# Altium schematic sheet RECEPTOR_AIS_BLK_R00.SchDoc
size A4; SheetNumber: 1; SheetTotal: 5
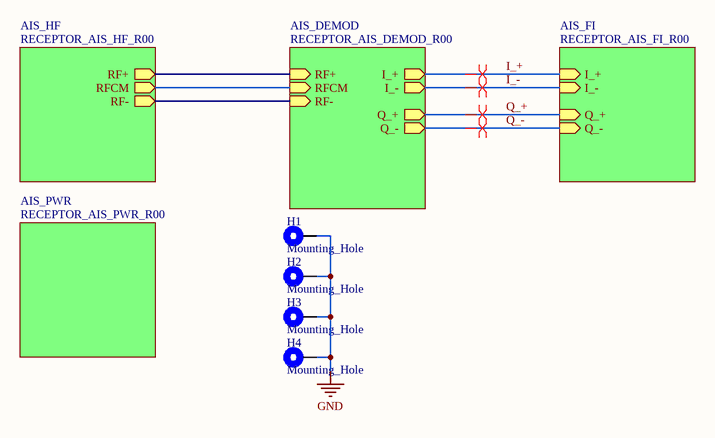
[diagram p0: RECEPTOR_AIS_BLK_R00.SchDoc]

## Parts
H1  Mounting_Hole  [Mounting_Hole_M2]  (no BOM)
H2  Mounting_Hole  [Mounting_Hole_M2]  (no BOM)
H3  Mounting_Hole  [Mounting_Hole_M2]  (no BOM)
H4  Mounting_Hole  [Mounting_Hole_M2]  (no BOM)

## Sub-sheets
AIS_DEMOD = RECEPTOR_AIS_DEMOD_R00: RF- (in), RF+ (in), Q_+ (out), Q_- (out), RFCM (in), I_- (out), I_+ (out)
AIS_FI = RECEPTOR_AIS_FI_R00: I_+ (in), I_- (in), Q_+ (in), Q_- (in)
AIS_HF = RECEPTOR_AIS_HF_R00: RF+ (out), RF- (out), RFCM (out)
AIS_PWR = RECEPTOR_AIS_PWR_R00: no entries

## Nets
GND: H1.1 H2.1 H3.1 H4.1
I_+: sheet AIS_DEMOD/I_+, sheet AIS_FI/I_+
I_-: sheet AIS_DEMOD/I_-, sheet AIS_FI/I_-
Q_+: sheet AIS_DEMOD/Q_+, sheet AIS_FI/Q_+
Q_-: sheet AIS_DEMOD/Q_-, sheet AIS_FI/Q_-
(unnamed): sheet AIS_HF/RF+, sheet AIS_DEMOD/RF+
(unnamed): sheet AIS_HF/RF-, sheet AIS_DEMOD/RF-
(unnamed): sheet AIS_HF/RFCM, sheet AIS_DEMOD/RFCM

## Layout directives
differential pair: I_+, I_-, Q_+, Q_-